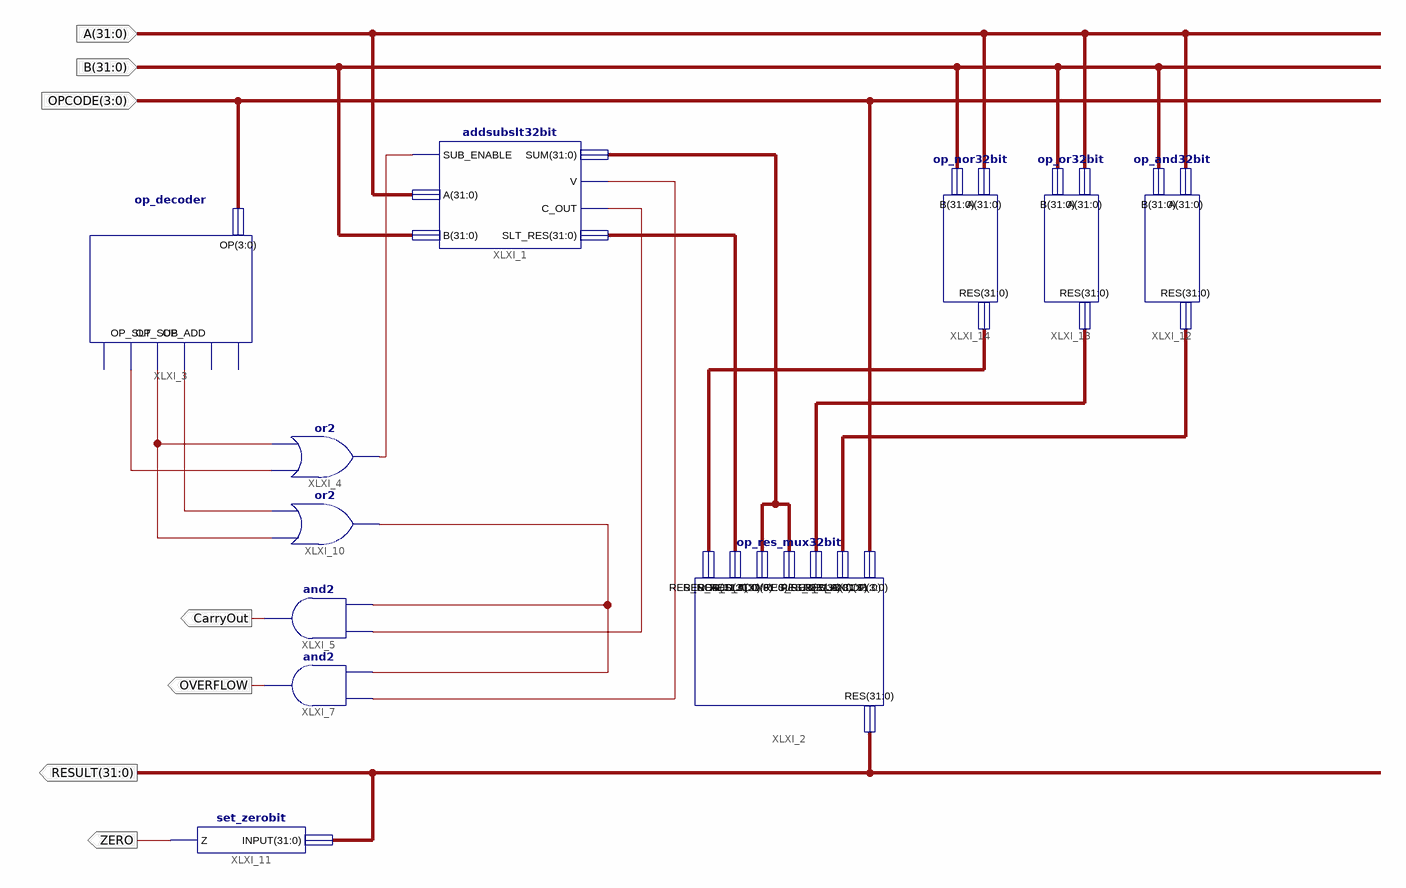
[diagram p0: schematic sheet 1]
// Xilinx ISE schematic ALU.sch (spartan3e) as structural Verilog: 11 symbols, 7 ports
module ALU (
  input  [3:0] OPCODE,
  input  [31:0] B,
  input  [31:0] A,
  output [31:0] RESULT,
  output CarryOut,
  output OVERFLOW,
  output ZERO
);

  wire XLXN_13, XLXN_14, XLXN_15, XLXN_16, XLXN_17, XLXN_28, XLXN_49;
  wire [31:0] XLXN_9, XLXN_10, XLXN_55, XLXN_56, XLXN_57;

  addsubslt32bit XLXI_1 (
    .SUB_ENABLE(XLXN_15), .A(A), .B(B), .SUM(XLXN_9), .V(XLXN_17), .C_OUT(XLXN_49), .SLT_RES(XLXN_10));
  op_res_mux32bit XLXI_2 (
    .OP(OPCODE), .RES_AND(XLXN_57), .RES_OR(XLXN_56), .RES_ADD(XLXN_9), .RES_SUB(XLXN_9), .RES_SLT(XLXN_10),
    .RES_NOR(XLXN_55), .RES(RESULT));
  op_decoder XLXI_3 (.OP(OPCODE), .OP_ADD(XLXN_28), .OP_SUB(XLXN_13), .OP_SLT(XLXN_14));  // open: OP_AND, OP_OR, OP_NOR
  or XLXI_4 (XLXN_15, XLXN_14, XLXN_13);
  and XLXI_7 (OVERFLOW, XLXN_16, XLXN_17);
  and XLXI_5 (CarryOut, XLXN_16, XLXN_49);
  or XLXI_10 (XLXN_16, XLXN_13, XLXN_28);
  set_zerobit XLXI_11 (.INPUT(RESULT), .Z(ZERO));
  op_and32bit XLXI_12 (.A(A), .B(B), .RES(XLXN_57));
  op_or32bit XLXI_13 (.RES(XLXN_56), .B(B), .A(A));
  op_nor32bit XLXI_14 (.RES(XLXN_55), .B(B), .A(A));
endmodule
